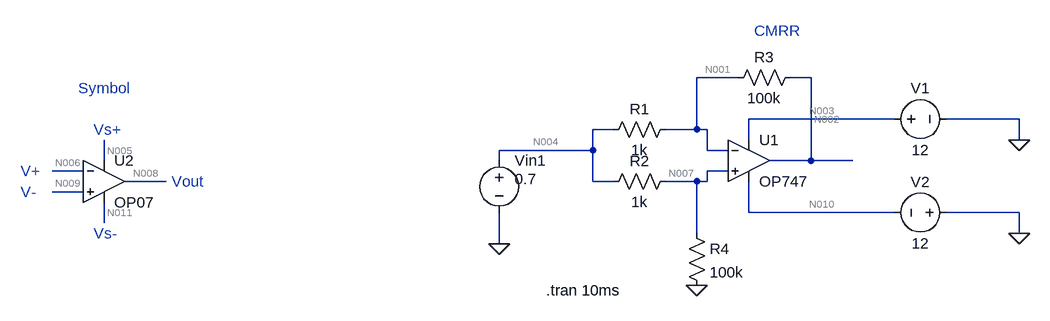
[diagram p0: schematic Exp1_CMRR.asc]
Exp1_CMRR.asc, the LTspice schematic file:
Version 4
SHEET 1 912 680
WIRE 192 -16 128 -16
WIRE 304 -16 272 -16
WIRE 432 48 208 48
WIRE 624 48 512 48
WIRE 0 64 -32 64
WIRE 128 64 128 -16
WIRE 128 64 80 64
WIRE 144 64 128 64
WIRE 208 80 208 48
WIRE 624 80 624 48
WIRE -32 96 -32 64
WIRE -32 96 -176 96
WIRE 144 96 144 64
WIRE 176 96 144 96
WIRE -784 112 -784 80
WIRE -176 112 -176 96
WIRE 304 112 304 -16
WIRE 304 112 240 112
WIRE 368 112 304 112
WIRE -816 128 -864 128
WIRE 176 128 144 128
WIRE -688 144 -752 144
WIRE -32 144 -32 96
WIRE 0 144 -32 144
WIRE 128 144 80 144
WIRE 144 144 144 128
WIRE 144 144 128 144
WIRE -816 160 -864 160
WIRE 208 192 208 144
WIRE 432 192 208 192
WIRE 624 192 512 192
WIRE -784 208 -784 176
WIRE 128 224 128 144
WIRE 624 224 624 192
WIRE -176 240 -176 192
FLAG 624 80 0
FLAG 624 224 0
FLAG -176 240 0
FLAG 128 304 0
SYMBOL voltage -176 96 R0
WINDOW 123 0 0 Left 0
WINDOW 39 0 0 Left 0
WINDOW 3 24 44 Left 2
SYMATTR Value 0.7
SYMATTR InstName Vin1
SYMBOL voltage 416 48 R270
WINDOW 0 32 56 VTop 2
WINDOW 3 -32 56 VBottom 2
WINDOW 123 0 0 Left 0
WINDOW 39 0 0 Left 0
SYMATTR InstName V1
SYMATTR Value 12
SYMBOL voltage 528 192 R90
WINDOW 0 -32 56 VBottom 2
WINDOW 3 32 56 VTop 2
WINDOW 123 0 0 Left 0
WINDOW 39 0 0 Left 0
SYMATTR InstName V2
SYMATTR Value 12
SYMBOL res 96 48 R90
WINDOW 0 0 56 VBottom 2
WINDOW 3 32 56 VTop 2
SYMATTR InstName R1
SYMATTR Value 1k
SYMBOL res 96 128 R90
WINDOW 0 0 56 VBottom 2
WINDOW 3 32 56 VTop 2
SYMATTR InstName R2
SYMATTR Value 1k
SYMBOL res 288 -32 R90
WINDOW 0 0 56 VBottom 2
WINDOW 3 32 56 VTop 2
SYMATTR InstName R3
SYMATTR Value 100k
SYMBOL OpAmps\\OP07 -784 80 R0
SYMATTR InstName U2
SYMBOL res 112 208 R0
SYMATTR InstName R4
SYMATTR Value 100k
SYMBOL OpAmps\\OP747 208 48 R0
SYMATTR InstName U1
TEXT -104 312 Left 2 !.tran 10ms
TEXT -800 64 Left 2 ;Vs+
TEXT -800 224 Left 2 ;Vs-
TEXT -680 144 Left 2 ;Vout
TEXT -912 128 Left 2 ;V+
TEXT -912 160 Left 2 ;V-
TEXT -824 0 Left 2 ;Symbol
TEXT 216 -88 Left 2 ;CMRR

The netlist it stands for:
* Exp1_CMRR.asc
Vin1 N004 0 0.7
V1 N003 0 12
V2 0 N010 12
R1 N001 N004 1k
R2 N007 N004 1k
R3 N002 N001 100k
XU2 N009 N006 N005 N011 N008 LT1001  ; OP07, pins In+ In- V+ V- OUT
R4 N007 0 100k
XU1 N007 N001 N003 N010 N002 OP747  ; pins In+ In- V+ V- OUT
.tran 10ms
* Vs+
* Vs-
* Vout
* V+
* V-
* Symbol
* CMRR
.lib LTC.lib
.backanno
.end

* Results of the author's LTspice run, read from the files saved beside the schematic
* Operating Point, zero values left out:
*   V(n004) = 700 mV
*   V(n003) = 12 V
*   V(n010) = -12 V
*   V(n001) = 693.2 mV
*   V(n007) = 693.1 mV
*   V(n002) = 8.356 mV
*   V(n006) = 149.7 kV
*   V(n009) = 149.7 kV
*   V(n005) = 149.7 kV
*   V(n011) = 149.7 kV
*   V(n008) = 149.7 kV
*   I(R1) = -6.839 µA
*   I(R2) = -6.92 µA
*   I(R3) = -6.848 µA
*   I(R4) = 6.931 µA
*   I(Vin1) = -13.76 µA
*   I(V1) = -279.7 µA
*   I(V2) = -286.6 µA
*   Ix(u2:5) = -2.025 pA
*   Ix(u1:1) = -11.02 nA
*   Ix(u1:2) = -9.018 nA
*   Ix(u1:99) = 279.7 µA
*   Ix(u1:50) = -286.6 µA
*   Ix(u1:45) = 6.848 µA